# EasyEDA Pro project coreboards.mod001.rp2350.v01.eprj

# Schematic coreboards.mod001.rp2350.v01
Board Name: coreboards.mod001.rp2350.v01; Create Date: 2026-03-10; Page Name: coreboard; Project Name: coreboards.mod001.rp2350.v01; Schematic Name: coreboards.mod001.rp2350.v01; Update Date: 2026-03-16; Company: EasyEDA.com; Page Size: A4; Version: V1.0
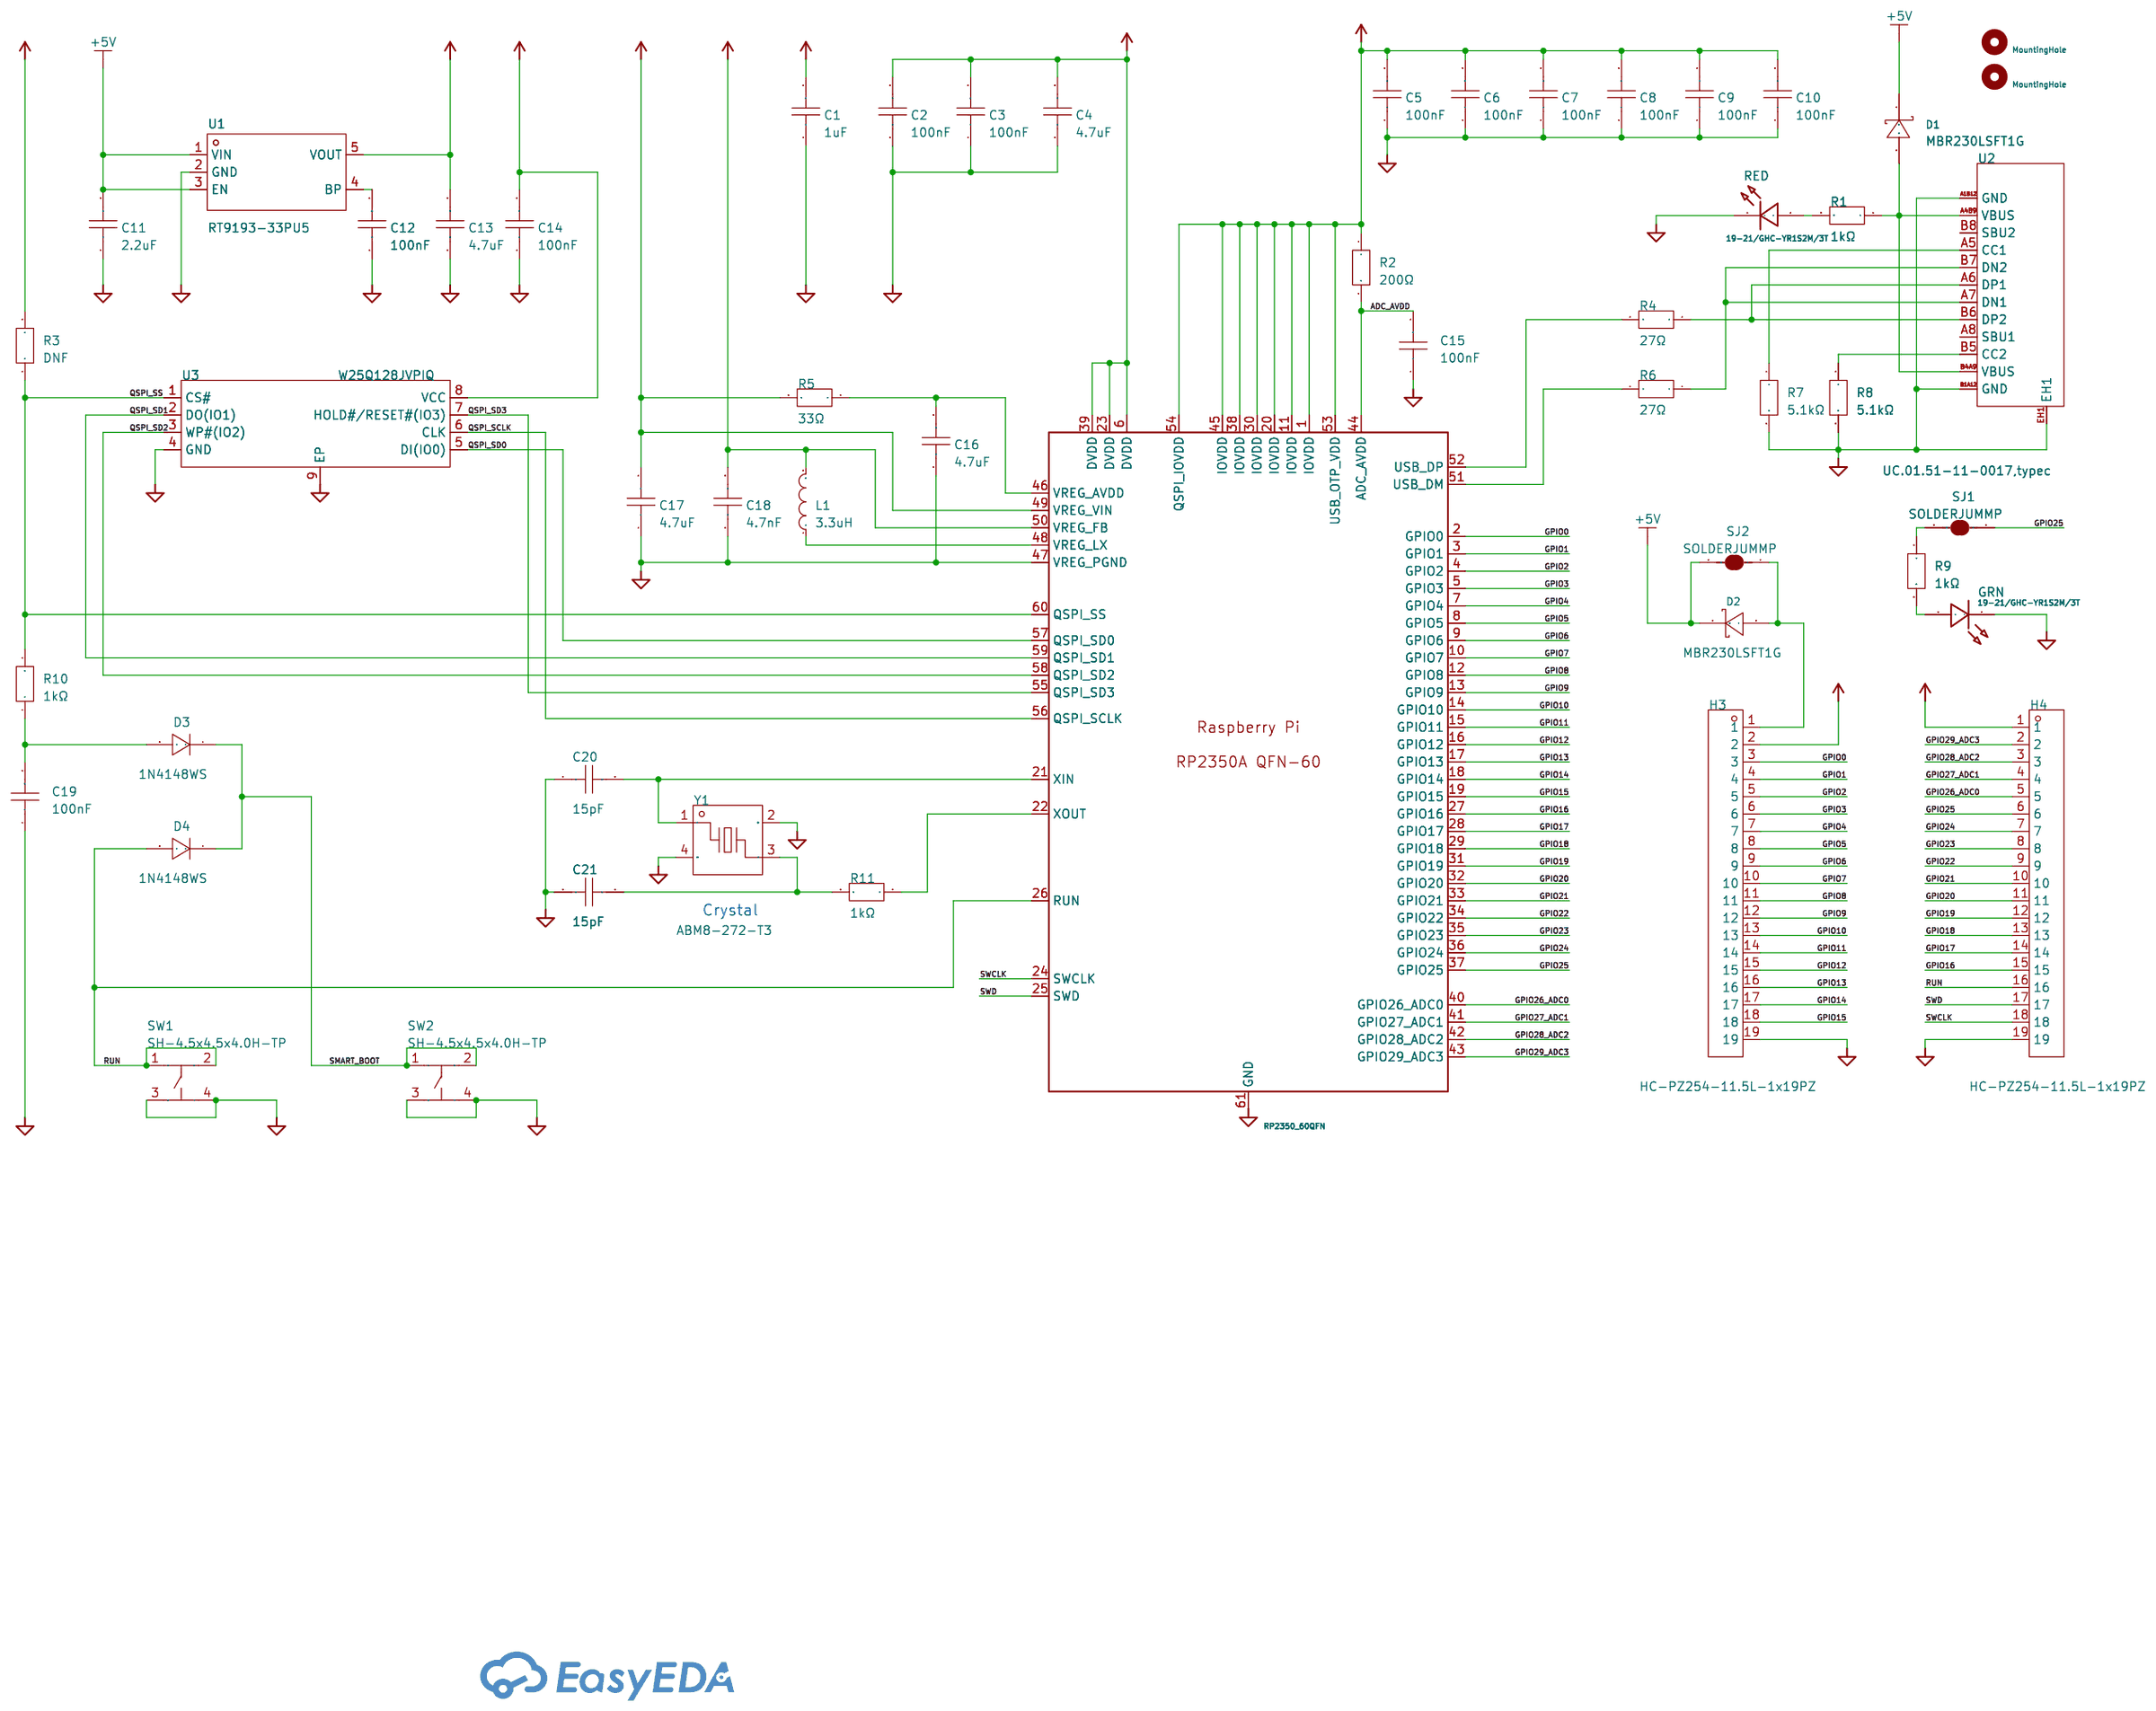
[diagram p0: schematic sheet]

## Parts
C1  1uF  [C0603]
C2  100nF  [C0603]
C3  100nF  [C0603]
C4  4.7uF  [C0603]
C5  100nF  [C0603]
C6  100nF  [C0603]
C7  100nF  [C0603]
C8  100nF  [C0603]
C9  100nF  [C0603]
C10  100nF  [C0603]
C11  2.2uF  [C0603]
C12  100nF  [C0603]
C13  4.7uF  [C0603]
C14  100nF  [C0603]
C15  100nF  [C0603]
C16  4.7uF  [C0603]
C17  4.7uF  [C0603]
C18  4.7nF  [C0603]
C19  100nF  [C0603]
C20  15pF  [C0603]
C21  15pF  [C0603]
D1  MBR230LSFT1G  [SOD-123FL_L2.7-W1.8-LS3.8-RD]
D2  MBR230LSFT1G  [SOD-123FL_L2.7-W1.8-LS3.8-RD]
D3  1N4148WS  [SOD-323_L1.8-W1.3-LS2.5-RD]
D4  1N4148WS  [SOD-323_L1.8-W1.3-LS2.5-RD]
GRN  19-21/GHC-YR1S2M/3T  [LED-SMD_L1.6-W0.8-RD]
H1  MountingHole  [MountingHole:MountingHole_2.7mm_M2.5]
H2  MountingHole  [MountingHole:MountingHole_2.7mm_M2.5]
H3  HC-PZ254-11.5L-1x19PZ  [HDR-TH_19P-P2.54-V-M]
H4  HC-PZ254-11.5L-1x19PZ  [HDR-TH_19P-P2.54-V-M]
L1  3.3uH  [IND-SMD_L2.0-W1.6_AOTA-B201610S3R3-101-T]
R1  1kΩ  [R0603]
R2  200Ω  [R0603]
R3  DNF  [R0603]
R4  27Ω  [R0603]
R5  33Ω  [R0603]
R6  27Ω  [R0603]
R7  5.1kΩ  [R0603]
R8  5.1kΩ  [R0603]
R9  1kΩ  [R0603]
R10  1kΩ  [R0603]
R11  1kΩ  [R0603]
RED  19-21/GHC-YR1S2M/3T  [LED-SMD_L1.6-W0.8-RD]
SJ1  SOLDERJUMMP  [SJ_2S-NO]
SJ2  SOLDERJUMMP  [SJ_2S-NO]
SW1  SH-4.5x4.5x4.0H-TP  [SW-SMD_4P-SH-4.5X4.5X4.0H-TP]
SW2  SH-4.5x4.5x4.0H-TP  [SW-SMD_4P-SH-4.5X4.5X4.0H-TP]
U1  RT9193-33PU5  [SC-70-5_L2.0-W1.3-P0.65-LS2.1-BL]
U2  UC.01.51-11-0017,typec  [TYPE-C-SMD_UC.01.51-11-0017]
U3  W25Q128JVPIQ  [WSON-8_L5.0-W6.0-P1.27-BL-EP]
U4  RP2350_60QFN  [RP2350_60QFN_minimal:RP2350-QFN-60-1EP_7x7_P0.4mm_EP3.4x3.4mm_ThermalVias]
Y1  ABM8-272-T3  [CRYSTAL-SMD_4P-L3.2-W2.5-BL-2]

## Library data of the parts
C1-C21 = C0603C102J2GECAUTO: LCSC Part Name: 1nF ±5% 200V; Supplier Part: C2169812; Manufacturer: KEMET(基美); Supplier Footprint: 0603; JLCPCB Part Class: Extended Part; Datasheet: https://item.szlcsc.com/datasheet/C0603C102J2GECAUTO/2261877.html; Supplier: LCSC; Tolerance: ±5%; Voltage Rating: 200V; Temperature Coefficient: C0G
D1 D2 = MBR230LSFT1G: LCSC Part Name: 电压:30V 电流:2A; Supplier Part: C126673; Manufacturer: onsemi(安森美); Supplier Footprint: SOD-123FL; JLCPCB Part Class: Extended Part; Datasheet: https://item.szlcsc.com/datasheet/MBR230LSFT1G/137953.html; Supplier: LCSC; Voltage - Forward(Vf@If): 430mV@2A; Voltage - DC Reverse(Vr): 30V; Current - Rectified: 2A; Reverse Leakage Current (Ir): 1mA@30V; Operating Junction Temperature Range: -55℃~+125℃; Non-Repetitive Peak Forward Surge Current: 40A
D3 D4 = 1N4148WS_C2128: LCSC Part Name: 丝印T4 1N4148WS; Supplier Part: C2128; Manufacturer: CJ(江苏长电/长晶); Supplier Footprint: SOD-323; JLCPCB Part Class: Basic Part; Datasheet: https://item.szlcsc.com/datasheet/1N4148WS/2485.html; Supplier: LCSC; Diode Configuration: Independent; Voltage - Forward(Vf@If): 1.25V@150mA; Voltage - DC Reverse(Vr): 100V; Current - Rectified: 150mA; Pd - Power Dissipation: 200mW; Reverse Leakage Current (Ir): 1uA@75V; Reverse Recovery Time (trr): 4ns; Non-Repetitive Peak Forward Surge Current: 2A
GRN RED = 19-21/GHC-YR1S2M/3T: Supplier: LCSC; Supplier Part: C605453; Manufacturer: EVERLIGHT(亿光); JLCPCB Part Class: Extended Part; Contributor: LCSC; spicePre: L
H1 = Mechanical_MountingHole: Attribute1: H2
H2 = Mechanical_MountingHole
H3 H4 = HC-PZ254-11.5L-1x19PZ: LCSC Part Name: 1x19P 间距:2.54mm 方针 直插; Supplier Part: C27985198; Manufacturer: HC(虹成电子); Supplier Footprint: 插件,P=2.54mm; JLCPCB Part Class: Extended Part; Datasheet: https://item.szlcsc.com/datasheet/HC-PZ254-11.5L-1x19PZ/29721156.html; Supplier: LCSC; Pin Structure: 1x19P; Pitch: 2.54mm; Circluar Pins/Square Pins: Pin Header; Mounting Type: Through Hole; Number of Rows: 1; Number of Pins: 19P; Current Rating: 3A; Length of Mating Pin: 6mm; Insulation Height: 2.5mm; Length of End Connection Pin: 3mm; Contact Material: Brass; Contact Plating: Gold; Operating Temperature: -40℃~+105℃; Color: Black
L1 = AOTA-B201610S3R3-101-T: LCSC Part Name: 3.3uH 2.4A; Supplier Part: C42411119; Manufacturer: ABRACON; Supplier Footprint: 0806; JLCPCB Part Class: Extended Part; Datasheet: https://item.szlcsc.com/datasheet/AOTA-B201610S3R3-101-T/44392932.html; Supplier: LCSC; Current Rating: 2.1A; Current - Saturation(Isat): 2.4A; DC Resistance(DCR): 115mΩ; Type: Molded Inductor
R1-R11 = RCC06031K50FKEA: LCSC Part Name: 厚膜电阻 1.5kΩ ±1% 200mW; Supplier Part: C4303195; Manufacturer: VISHAY(威世); Supplier Footprint: 0603; JLCPCB Part Class: Extended Part; Datasheet: https://item.szlcsc.com/datasheet/RCC06031K50FKEA/4873636.html; Supplier: LCSC; Type: Thick Film Resistor; Tolerance: ±1%; Power(Watts): 200mW; Temperature Coefficient: ±100ppm/℃; Operating Temperature: -55℃~+155℃
SJ1 SJ2 = SOLDERJUMPERNO: Contributor: SparkFun; spicePre: S
SW1 SW2 = SH-4.5x4.5x4.0H-TP: LCSC Part Name: TS4540TP 250gf编带; Supplier Part: C52092029; Manufacturer: SHOU HAN(首韩); Supplier Footprint: SMD; JLCPCB Part Class: Extended Part; Datasheet: https://item.szlcsc.com/datasheet/SH-4.5x4.5x4.0H-TP/54864053.html; Supplier: LCSC
U1 = RT9193-33PU5: Supplier Part: C23384; Supplier Footprint: SC-70-5; JLCPCB Part Class: Extended Part; Supplier: LCSC
U2 = UC.01.51-11-0017,typec: Supplier Part: C9900066641; Supplier Footprint: usb-c-smd_type-c-6pin; JLCPCB Part Class: Extended Part; Supplier: LCSC
U3 = W25Q128JVPIQ_C2803379: LCSC Part Name: 支持双路/四路SPI接口的3V、128Mbit 串行闪存; Supplier Part: C2803379; Manufacturer: Winbond(华邦); Supplier Footprint: WSON-8-EP(5x6); JLCPCB Part Class: Extended Part; Datasheet: https://item.szlcsc.com/datasheet/W25Q128JVPIQ/2946213.html; Supplier: LCSC; Interface: SPI; Memory Size: 128Mbit; Clock Frequency: 133MHz; Voltage - Supply: 2.7V~3.6V; Program / Erase Cycles: 100,000 Cycles; Page Programming Time (Tpp): 400us; Block Erase Time(tBE): 120ms@(32KB); Data Retention - TDR (Year): 20 Years; Operating Temperature: -40℃~+85℃
U4 = MCU_RaspberryPi_RP2350_RP2350_60QFN: Attribute1: U1
Y1 = ABM8-272-T3: Supplier Part: C9900091606; Supplier Footprint: SMD; Supplier: LCSC

## Nets
+5V: C11.2 D1.1(C) D2.1(C) SJ2.2 U1.1(VIN) U1.3(EN)
ADC_AVDD: C15.2 R2.2 U4.44(ADC_AVDD)
GPIO0: H3.3 U4.2(GPIO0)
GPIO1: H3.4 U4.3(GPIO1)
GPIO2: H3.5 U4.4(GPIO2)
GPIO3: H3.6 U4.5(GPIO3)
GPIO4: H3.7 U4.7(GPIO4)
GPIO5: H3.8 U4.8(GPIO5)
GPIO6: H3.9 U4.9(GPIO6)
GPIO7: H3.10 U4.10(GPIO7)
GPIO8: H3.11 U4.12(GPIO8)
GPIO9: H3.12 U4.13(GPIO9)
GPIO10: H3.13 U4.14(GPIO10)
GPIO11: H3.14 U4.15(GPIO11)
GPIO12: H3.15 U4.16(GPIO12)
GPIO13: H3.16 U4.17(GPIO13)
GPIO14: H3.17 U4.18(GPIO14)
GPIO15: H3.18 U4.19(GPIO15)
GPIO16: H4.15 U4.27(GPIO16)
GPIO17: H4.14 U4.28(GPIO17)
GPIO18: H4.13 U4.29(GPIO18)
GPIO19: H4.12 U4.31(GPIO19)
GPIO20: H4.11 U4.32(GPIO20)
GPIO21: H4.10 U4.33(GPIO21)
GPIO22: H4.9 U4.34(GPIO22)
GPIO23: H4.8 U4.35(GPIO23)
GPIO24: H4.7 U4.36(GPIO24)
GPIO25: H4.6 SJ1.1 U4.37(GPIO25)
GPIO26_ADC0: H4.5 U4.40(GPIO26_ADC0)
GPIO27_ADC1: H4.4 U4.41(GPIO27_ADC1)
GPIO28_ADC2: H4.3 U4.42(GPIO28_ADC2)
GPIO29_ADC3: H4.2 U4.43(GPIO29_ADC3)
POWER_+1V1: C2.2 C3.2 C4.2 C18.2 L1.2 U4.6(DVDD) U4.23(DVDD) U4.39(DVDD) U4.50(VREG_FB)
POWER_+3V3: C1.2 C5.2 C6.2 C7.2 C8.2 C9.2 C10.2 C13.2 C14.2 C17.2 H3.2 H4.1 R2.1 R3.2 R5.2 U1.5(VOUT) U3.8(VCC) U4.1(IOVDD) U4.11(IOVDD) U4.20(IOVDD) U4.30(IOVDD) U4.38(IOVDD) U4.45(IOVDD) U4.49(VREG_VIN) U4.53(USB_OTP_VDD) U4.54(QSPI_IOVDD)
POWER_GND: C1.1 C2.1 C3.1 C4.1 C5.1 C6.1 C7.1 C8.1 C9.1 C10.1 C11.1 C12.1 C13.1 C14.1 C15.1 C16.1 C17.1 C18.1 C19.1 C20.1 C21.1 GRN.1(-) H3.19 H4.19 R7.2 R8.2 RED.1(-) SW1.3 SW1.4 SW2.3 SW2.4 U1.2(GND) U2.A1B12(GND) U2.B1A12(GND) U2.EH1 U3.4(GND) U3.9(EP) U4.47(VREG_PGND) U4.61(GND) Y1.2(GND) Y1.4(GND)
QSPI_SCLK: U3.6(CLK) U4.56(QSPI_SCLK)
QSPI_SD0: U3.5(DI(IO0)) U4.57(QSPI_SD0)
QSPI_SD1: U3.2(DO(IO1)) U4.59(QSPI_SD1)
QSPI_SD2: U3.3(WP#(IO2)) U4.58(QSPI_SD2)
QSPI_SD3: U3.7(HOLD#/RESET#(IO3)) U4.55(QSPI_SD3)
QSPI_SS: R3.1 R10.2 U3.1(CS#) U4.60(QSPI_SS)
RUN: D4.2(A) H4.16 SW1.1 SW1.2 U4.26(RUN)
SMART_BOOT: D3.1(K) D4.1(K) SW2.1 SW2.2
SWCLK: H4.18 U4.24(SWCLK)
SWD: H4.17 U4.25(SWD)
$1N452: R4.2 U4.52(USB_DP)
$1N453: R6.2 U4.51(USB_DM)
$1N454: R4.1 U2.A6(DP1) U2.B6(DP2)
$1N455: R6.1 U2.A7(DN1) U2.B7(DN2)
$1N456: D1.2(A) R1.1 U2.A4B9(VBUS) U2.B4A9(VBUS)
$1N458: R7.1 U2.A5(CC1)
$1N459: R8.1 U2.B5(CC2)
$1N1604: C21.2 R11.2 Y1.3
$1N1613: R11.1 U4.22(XOUT)
$1N2950: C12.2 U1.4(BP)
$1N4805: C19.2 D3.2(A) R10.1
$1N6481: D2.2(A) H3.1 SJ2.1
$1N8578: R1.2 RED.2(+)
$1N8767: R9.1 SJ1.2
$1N8801: GRN.2(+) R9.2
$1N10436: C20.2 U4.21(XIN) Y1.1
$1N16119: C16.2 R5.1 U4.46(VREG_AVDD)
$1N16408: L1.1 U4.48(VREG_LX)

Not connected (* = marked no-connect by the designer): U2 A8(SBU1) B8(SBU2)

## Notes on the sheet
- Crystal

# Board coreboards.mod001.rp2350.v01
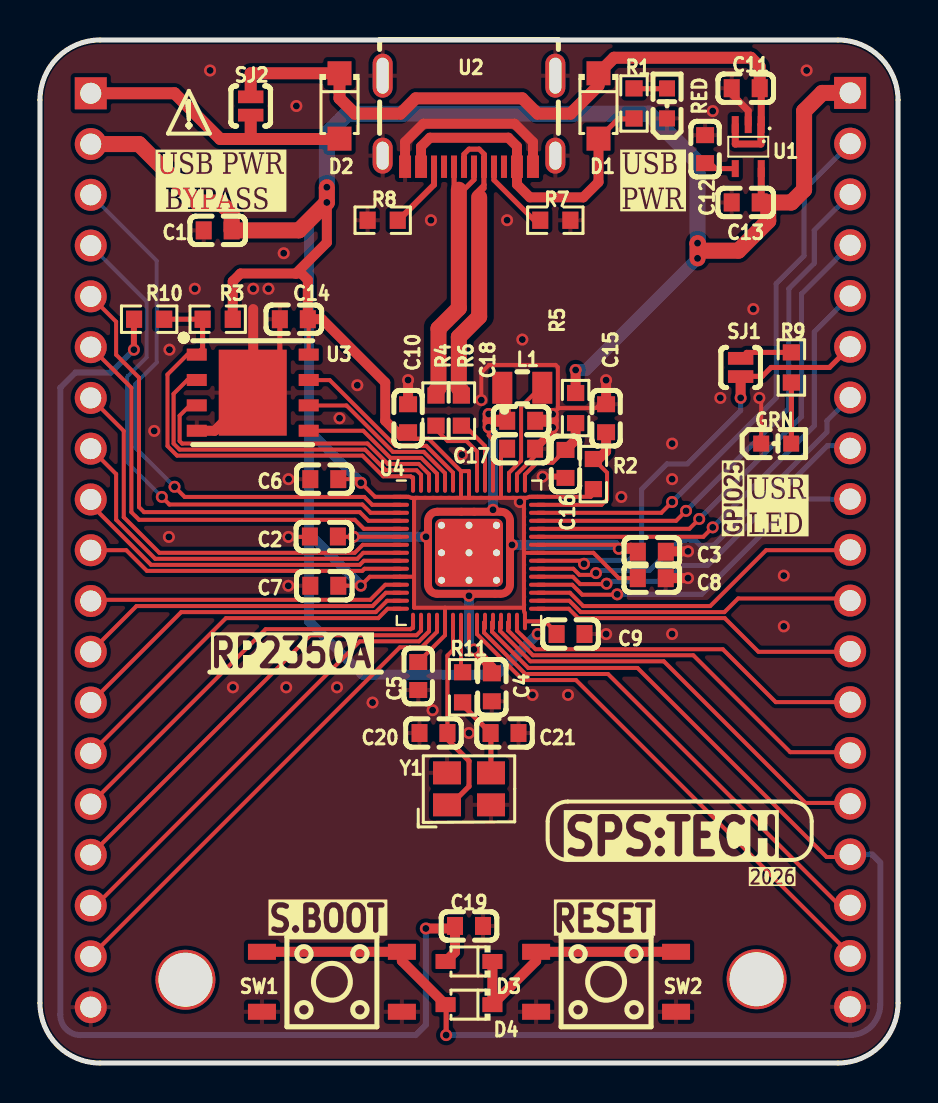
[diagram p1: board, top side]
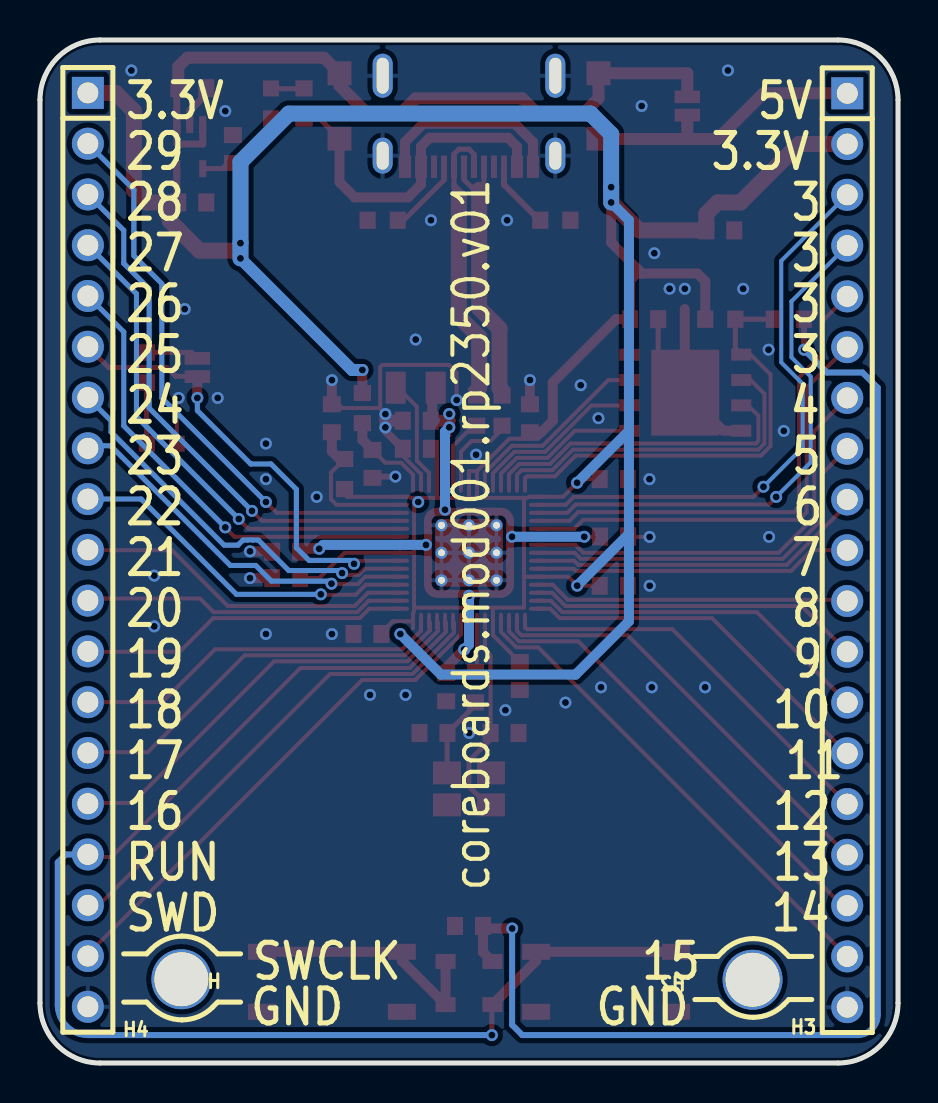
[diagram p2: board, bottom side, seen from below]

Outline 42.93 x 51.18 mm; copper layers: Top Layer, Bottom Layer. Coordinates in mm from the lower left corner of the outline.
Outline path: 0,48.18 0,3 arc(0.88,0.88) 3,0 39.93,0 arc(42.05,0.88) 42.93,3 42.93,48.18 arc(42.05,50.3) 39.93,51.18 3,51.18 arc(0.88,50.3) 0,48.18
Stack: Top Layer 0.035mm / Dielectric1 1.51mm FR4 er 4.5 / Bottom Layer 0.035mm

## Design rules (mm)
template: JLCPCB Capability(Two Layers Board)
spacing copperThickness1oz (default): track to track 0.102, other pairs 0.152 to 0.3
spacing copperThickness2oz: track to track 0.203, other pairs 0.152 to 0.3
track width copperThickness1oz (default): min 0.127, default 0.254, max 2.54
track width copperThickness2oz: min 0.203, default 0.254, max 2.54
differential pair differentialPair (default): width min 0.127, default 0.254, max 2.54; gap min 0.152, default 0.152
via viaSize (default): diameter min 0.5, default 0.61, max 10; hole min 0.3, default 0.305, max 6.3

## Placement (name value [footprint] x y rotation side)
C1  1uF  [C0603]  8.89 41.66 0 top
C2  100nF  [C0603]  14.2 26.34 0 top
C3  100nF  [C0603]  30.61 25.58 180 top
C4  4.7uF  [C0603]  22.61 18.8 90 top
C5  100nF  [C0603]  18.92 19.36 90 top
C6  100nF  [C0603]  14.22 29.21 0 top
C7  100nF  [C0603]  14.22 23.88 0 top
C8  100nF  [C0603]  30.61 24.26 180 top
C9  100nF  [C0603]  26.54 21.46 180 top
C10  100nF  [C0603]  18.41 32.26 270 top
C11  2.2uF  [C0603]  35.31 48.77 0 top
C12  100nF  [C0603]  33.27 45.72 270 top
C13  4.7uF  [C0603]  35.31 43.05 0 top
C14  100nF  [C0603]  12.7 37.21 0 top
C15  100nF  [C0603]  28.32 32.26 270 top
C16  4.7uF  [C0603]  26.29 29.97 90 top
C17  4.7uF  [C0603]  24.07 30.73 180 top
C18  4.7nF  [C0603]  24.07 32.13 180 top
C19  100nF  [C0603]  21.46 6.86 180 top
C20  15pF  [C0603]  19.69 16.51 0 top
C21  15pF  [C0603]  23.24 16.51 180 top
D1  MBR230LSFT1G  [SOD-123FL_L2.7-W1.8-LS3.8-RD]  27.94 47.88 270 top
D2  MBR230LSFT1G  [SOD-123FL_L2.7-W1.8-LS3.8-RD]  14.99 47.88 270 top
D3  1N4148WS  [SOD-323_L1.8-W1.3-LS2.5-RD]  21.46 5.08 180 top
D4  1N4148WS  [SOD-323_L1.8-W1.3-LS2.5-RD]  21.46 2.92 180 top
GRN  19-21/GHC-YR1S2M/3T  [LED-SMD_L1.6-W0.8-RD]  36.83 30.99 0 top
H1  MountingHole  [MountingHole:MountingHole_2.7mm_M2.5]  35.85 4.19 0 top
H2  MountingHole  [MountingHole:MountingHole_2.7mm_M2.5]  7.28 4.17 0 top
H3  HC-PZ254-11.5L-1x19PZ  [HDR-TH_19P-P2.54-V-M]  2.54 25.65 270 bottom
H4  HC-PZ254-11.5L-1x19PZ  [HDR-TH_19P-P2.54-V-M]  40.53 25.67 270 bottom
L1  3.3uH  [IND-SMD_L2.0-W1.6_AOTA-B201610S3R3-101-T]  24.13 33.78 180 top
R1  1kΩ  [R0603]  29.72 48.01 90 top
R2  200Ω  [R0603]  27.69 29.46 90 top
R3  DNF  [R0603]  8.89 37.21 0 top
R4  27Ω  [R0603]  19.81 32.64 270 top
R5  33Ω  [R0603]  26.8 32.77 90 top
R6  27Ω  [R0603]  21.08 32.64 270 top
R7  5.1kΩ  [R0603]  25.78 42.16 0 top
R8  5.1kΩ  [R0603]  17.15 42.16 180 top
R9  1kΩ  [R0603]  37.59 34.8 270 top
R10  1kΩ  [R0603]  5.46 37.21 0 top
R11  1kΩ  [R0603]  21.14 18.8 270 top
RED  19-21/GHC-YR1S2M/3T  [LED-SMD_L1.6-W0.8-RD]  31.37 48.01 90 top
SJ1  SOLDERJUMMP  [SJ_2S-NO]  35.05 34.8 90 top
SJ2  SOLDERJUMMP  [SJ_2S-NO]  10.54 47.88 90 top
SW1  SH-4.5x4.5x4.0H-TP  [SW-SMD_4P-SH-4.5X4.5X4.0H-TP]  14.6 4.06 0 top
SW2  SH-4.5x4.5x4.0H-TP  [SW-SMD_4P-SH-4.5X4.5X4.0H-TP]  28.32 4.06 0 top
U1  RT9193-33PU5  [SC-70-5_L2.0-W1.3-P0.65-LS2.1-BL]  35.43 45.85 180 top
U2  UC.01.51-11-0017,typec  [TYPE-C-SMD_UC.01.51-11-0017]  21.46 47.12 180 top
U3  W25Q128JVPIQ  [WSON-8_L5.0-W6.0-P1.27-BL-EP]  10.64 33.54 270 top
U4  RP2350_60QFN  [RP2350_60QFN_minimal:RP2350-QFN-60-1EP_7x7_P0.4mm_EP3.4x3.4mm_ThermalVias]  21.46 25.53 0 top
Y1  ABM8-272-T3  [CRYSTAL-SMD_4P-L3.2-W2.5-BL-2]  21.46 13.72 0 top

## Footprints (pads in the part's own frame, mm; a bottom-side part is the same pattern mirrored in y, then rotated)
C0603
  rect 0.8x0.9 smd: 1(-0.7,0) 2(0.7,0)
CRYSTAL-SMD_4P-L3.2-W2.5-BL-2
  rect 1.4x1.15 smd: 1(-1.1,-0.8) 2(1.1,-0.8) 3(1.1,0.8) 4(-1.1,0.8)
HDR-TH_19P-P2.54-V-M
  rect 1.6x1.6 hole 1.05: 1(-22.86,0)
  round 1.6 hole 1.05: 2(-20.32,0) 3(-17.78,0) 4(-15.24,0) 5(-12.7,0) 6(-10.16,0) 7(-7.62,0) 8(-5.08,0) 9(-2.54,0) 10(0,0) 11(2.54,0) 12(5.08,0) 13(7.62,0) 14(10.16,0) 15(12.7,0) 16(15.24,0) 17(17.78,0) 18(20.32,0) 19(22.86,0)
IND-SMD_L2.0-W1.6_AOTA-B201610S3R3-101-T
  rect 1x1.6 smd: 1(-1,0) 2(1,0)
LED-SMD_L1.6-W0.8-RD
  rect 0.8x0.8 smd: 1(-0.75,0) 2(0.75,0)
MountingHole:MountingHole_2.7mm_M2.5
  round 3 hole 2.7: (0,0)
R0603
  rect 0.806x0.864 smd: 1(-0.753,0) 2(0.753,0)
RP2350_60QFN_minimal:RP2350-QFN-60-1EP_7x7_P0.4mm_EP3.4x3.4mm_ThermalVias
  rrect 1.2x1.2 smd: (-0.7,0.7) (-0.7,-0.7) (0.7,0.7) (0.7,-0.7)
  rrect 0.875x0.2 smd: 1(-3.438,2.8) 2(-3.438,2.4) 3(-3.438,2) 4(-3.438,1.6) 5(-3.438,1.2) 6(-3.438,0.8) 7(-3.438,0.4) 8(-3.438,0) 9(-3.438,-0.4) 10(-3.438,-0.8) 11(-3.438,-1.2) 12(-3.438,-1.6) 13(-3.438,-2) 14(-3.438,-2.4) 15(-3.438,-2.8) 31(3.438,-2.8) 32(3.438,-2.4) 33(3.438,-2) 34(3.438,-1.6) 35(3.438,-1.2) 36(3.438,-0.8) 37(3.438,-0.4) 38(3.438,0) 39(3.438,0.4) 40(3.438,0.8) 41(3.438,1.2) 42(3.438,1.6) 43(3.438,2) 44(3.438,2.4) 45(3.438,2.8)
  rrect 0.2x0.875 smd: 16(-2.8,-3.438) 17(-2.4,-3.438) 18(-2,-3.438) 19(-1.6,-3.438) 20(-1.2,-3.438) 21(-0.8,-3.438) 22(-0.4,-3.438) 23(0,-3.438) 24(0.4,-3.438) 25(0.8,-3.438) 26(1.2,-3.438) 27(1.6,-3.438) 28(2,-3.438) 29(2.4,-3.438) 30(2.8,-3.438) 46(2.8,3.438) 47(2.4,3.438) 48(2,3.438) 49(1.6,3.438) 50(1.2,3.438) 51(0.8,3.438) 52(0.4,3.438) 53(0,3.438) 54(-0.4,3.438) 55(-0.8,3.438) 56(-1.2,3.438) 57(-1.6,3.438) 58(-2,3.438) 59(-2.4,3.438) 60(-2.8,3.438)
  round 0.6 hole 0.35: 61(-1.375,1.375) 61(-1.375,0) 61(-1.375,-1.375) 61(0,1.375) 61(0,0) 61(0,-1.375) 61(1.375,0) 61(1.375,-1.375)
  rrect 3.4x3.4 smd: 61(0,0)
  round 0.6 hole 0.36: 61(1.375,1.375)
SC-70-5_L2.0-W1.3-P0.65-LS2.1-BL
  rect 0.35x0.85 smd: 1(-0.65,-1.1) 2(0,-1.1) 3(0.65,-1.1) 4(0.65,1.1) 5(-0.65,1.1)
SJ_2S-NO
  rect 0.635x1.27 smd: 1(-0.457,0) 2(0.457,0)
SOD-123FL_L2.7-W1.8-LS3.8-RD
  rect 1.2x1.2 smd: 1(-1.635,0) 2(1.635,0)
SOD-323_L1.8-W1.3-LS2.5-RD
  rect 1x0.75 smd: 1(-1.173,0) 2(1.173,0)
SW-SMD_4P-SH-4.5X4.5X4.0H-TP
  rect 1.4x0.8 smd: 1(-3.5,1.5) 2(3.5,1.5) 3(-3.5,-1.5) 4(3.5,-1.5)
TYPE-C-SMD_UC.01.51-11-0017
  rect 0.6x1.12 smd: A1B12(-3.2,2.277) A4B9(-2.4,2.277) B1A12(3.2,2.277) B4A9(2.4,2.277)
  rect 0.3x1.12 smd: A5(-1.25,2.277) A6(-0.25,2.277) A7(0.25,2.277) A8(1.25,2.277) B5(1.75,2.277) B6(0.75,2.277) B7(-0.75,2.277) B8(-1.75,2.277)
  oval 1x1.8 hole 0.6x1.4: EH1(-4.32,1.722) EH1(4.32,1.722)
  oval 1x2.2 hole 0.6x1.8: EH1(-4.32,-2.277) EH1(4.32,-2.277)
WSON-8_L5.0-W6.0-P1.27-BL-EP
  rect 0.6x1 smd: 1(-1.905,-2.8) 2(-0.635,-2.8) 3(0.635,-2.8) 4(1.905,-2.8) 5(1.905,2.8) 6(0.635,2.8) 7(-0.635,2.8) 8(-1.905,2.8)
  rect 4.3x3.4 smd: 9(0,0)

## Nets
As in the schematic.

Pads without a net: U2 A8 B8

## Via types
v1: diameter 0.6, hole 0.35, Top Layer to Bottom Layer, 78 vias

## Routing (per net, layer and track width the routed paths; a pad name or vN(x,y) marks a point on that pad's centre or on a via; arc(x,y) is an arc through that point)
+5V: length 36.6
  Top Layer w0.35: 36.08,48.64 U1.1 36.07,46.95 36.07,45.97 34.78,45.97 U1.3
  Top Layer w0.6: C11.2 36.01,49.85 35.56,50.29 28.72,50.29 D1.1 27.94,48.89 26.54,47.5 24.89,47.5 24.13,48.26 18.8,48.26 18.03,47.5 15.75,47.5 14.99,48.26 D2.1 10.54,49.51 SJ2.2
ADC_AVDD: length 7.3
  Top Layer w0.2: R2.2 28.37,29.53 28.37,28.2 28.09,27.93 U4.44
  Top Layer w0.5: 28.32,31.3 28.32,30.6 27.81,30.09
GPIO0: length 28.9
  Top Layer w0.2: U4.2 16.62,27.93 16.22,28.32 7.24,28.32 v1(6.73,28.83)
  Bottom Layer w0.2: H3.3 5.84,40.13 5.84,35.05 4.77,33.98 4.77,30.79 v1(6.73,28.83)
GPIO1: length 27.1
  Top Layer w0.2: U4.3 16.54,27.53 16.13,27.94 6.48,27.94 v1(6.1,28.32)
  Bottom Layer w0.2: v1(6.1,28.32) 4.37,30.05 4.37,34.34 5.33,35.31 5.33,38.1 H3.4
GPIO2: length 24.9
  Top Layer w0.2: H3.5 3.81,37.08 3.81,35.43 4.95,34.29 4.95,27.81 5.21,27.56 16,27.56 16.43,27.13 18.03,27.13
GPIO3: length 22.9
  Top Layer w0.2: H3.6 4.57,33.78 4.57,27.56 4.95,27.18 15.75,27.18 16.2,26.73 U4.5
GPIO4: length 21.4
  Top Layer w0.2: U4.7 16.15,25.93 15.75,25.53 5.97,25.53 4.19,27.3 4.19,31.62 H3.7
GPIO5: length 19.2
  Top Layer w0.2: H3.8 3.81,29.46 3.81,27.18 5.76,25.22 15.87,25.22 16.18,25.53 U4.8
GPIO6: length 17.1
  Top Layer w0.2: H3.9 2.54,27.94 5.56,24.92 16,24.92 16.2,25.13 18.03,25.13
GPIO7: length 16
  Top Layer w0.2: H3.10 4.32,25.65 5.35,24.62 16.12,24.62 16.23,24.73 U4.10
GPIO8: length 15.8
  Top Layer w0.2: U4.12 17.28,23.93 16.52,23.17 2.6,23.17 H3.11
GPIO9: length 16.7
  Top Layer w0.2: H3.12 4.83,22.86 16.64,22.86 17.3,23.53 U4.13
GPIO10: length 17.6
  Top Layer w0.2: 18.03,23.13 17.37,23.13 16.8,22.56 7.06,22.56 H3.13
GPIO11: length 18.5
  Top Layer w0.2: U4.15 17.39,22.73 16.92,22.26 9.3,22.26 H3.14
GPIO12: length 20.1
  Top Layer w0.2: H3.15 11.29,21.7 18.54,21.7 18.66,21.82 18.66,22.09
GPIO13: length 21.6
  Top Layer w0.2: H3.16 13.53,21.4 18.84,21.4 19.06,21.62 U4.17
GPIO14: length 23.1
  Top Layer w0.2: H3.17 2.78,7.87 16,21.1 18.96,21.1 19.46,21.6 U4.18
GPIO15: length 24.6
  Top Layer w0.2: U4.19 19.86,21.57 19.09,20.8 18,20.8 H3.18
GPIO16: length 21.6
  Top Layer w0.2: H4.15 40.49,13.01 38.3,13.01 31.21,20.1 24.54,20.1 23.01,21.62 23.01,22.04 U4.27
GPIO17: length 20.1
  Top Layer w0.2: U4.28 23.41,22.04 23.41,21.65 24.66,20.4 32.69,20.4 37.53,15.55 40.49,15.55 H4.14
GPIO18: length 18.6
  Top Layer w0.2: U4.29 23.86,21.62 24.79,20.7 34.16,20.7 36.81,18.05 H4.13
GPIO19: length 16.5
  Top Layer w0.2: H4.12 40.51,20.57 35.94,20.57 34.26,22.26 26.93,22.26 26.46,22.73 U4.31
GPIO20: length 16.2
  Top Layer w0.2: H4.11 40.42,23.24 34.93,23.24 34.24,22.56 27.05,22.56 26.48,23.13 24.9,23.13
GPIO21: length 17.1
  Top Layer w0.2: U4.33 26.51,23.53 27.18,22.86 33.53,22.86 36.32,25.65 40.51,25.65 H4.10
GPIO22: length 17.8
  Top Layer w0.2: U4.34 26.63,23.93 27.13,23.43 28.86,23.43 v1(28.88,23.45)
  Bottom Layer w0.254: v1(28.88,23.45) 33.1,23.45 37.87,28.21 H4.9
GPIO23: length 18.7
  Top Layer w0.2: v1(28.34,23.98) 28.32,23.96 27.02,23.96 26.66,24.33 24.9,24.33
  Bottom Layer w0.254: v1(28.34,23.98) 28.47,24.11 31.35,24.11 32.13,24.89 33.4,24.89 39.39,30.88 40.4,30.88 H4.8
GPIO24: length 20
  Top Layer w0.2: v1(27.81,24.51) 27.72,24.42 26.99,24.42 26.68,24.73 U4.36
  Bottom Layer w0.254: v1(27.81,24.51) 27.94,24.51 28.07,24.64 30.48,24.64 32,26.16 32.29,26.16 arc(32.42,26.18) 32.55,26.16 32.77,26.16 33.02,25.91 33.71,25.91 39.37,31.57 39.37,32.13 40.53,33.29
GPIO25: length 22.9
  Top Layer w0.2: v1(27.22,24.97) 27.06,25.13 24.9,25.13
  Top Layer w0.254: SJ1.1 35.06,34.35 36.13,34.35 36.58,34.8 39.5,34.8 H4.6
  Top Layer w0.5: v1(35.05,33.27) SJ1.1
  Bottom Layer w0.254: v1(35.05,33.27) 35.05,32.64 32.38,29.97 31.37,29.97 30.1,28.7 30.1,25.78 29.46,25.15 27.39,25.15 v1(27.22,24.97)
GPIO26_ADC0: length 23.4
  Top Layer w0.2: 24.9,26.33 33.19,26.33 v1(33.66,26.8)
  Bottom Layer w0.254: H4.5 38.74,36.58 38.74,31.88 v1(33.66,26.8)
GPIO27_ADC1: length 25.1
  Top Layer w0.2: v1(32.98,27.22) 32.49,26.73 U4.41
  Bottom Layer w0.254: v1(32.98,27.22) 38.1,32.34 38.1,38.48 H4.4
GPIO28_ADC2: length 26.9
  Top Layer w0.2: v1(32.32,27.62) 31.83,27.13 24.9,27.13
  Bottom Layer w0.254: H4.3 38.74,41.66 38.74,40 37.47,38.73 37.47,32.77 v1(32.32,27.62)
GPIO29_ADC3: length 28.6
  Top Layer w0.2: U4.43 31.08,27.53 v1(31.62,28.07)
  Bottom Layer w0.254: 40.53,45.99 38.23,43.69 38.23,40.39 36.83,38.99 36.83,33.27 v1(31.62,28.07)
POWER_+1V1: length 50
  Top Layer w0.2: v1(22.45,31.8) 22.45,31.4 22.65,31.2 22.65,30.18 22.66,30.17 22.66,28.96 ; 29.76,25.73 29.56,25.93 U4.39 ; v1(21.71,20.69) 21.46,20.93 U4.23 ; 18.03,26.33 v1(15.69,26.33) 14.92,26.33 C2.2
  Top Layer w0.4: 19.41,27.12 arc(19.55,27.44) 19.87,27.58 23,27.58 ; 19.41,27.06 19.41,23.94 arc(19.55,23.61) 19.87,23.47 23,23.47 ; 23.05,27.58 arc(23.38,27.44) 23.51,27.12 ; 23.51,23.99 23.51,27.06 ; 23.51,23.94 arc(23.38,23.61) 23.05,23.47 ; 23.51,24.76 23.51,24.51
  Top Layer w0.5: v1(21.71,20.69) 22.61,19.79 C4.2 ; v1(28.96,25.73) 29.76,25.73 C3.2 ; 23.3,32.13 23.3,33.61 L1.2
  Top Layer w0.6: 22.45,32.13 v1(22.45,31.8) ; 22.45,32.13 v1(22.45,32.47) ; 22.45,32.13 23.3,32.13
  Bottom Layer w0.5: v1(23.62,25.92) 28.76,25.92 v1(28.96,25.73) ; v1(19.31,26.33) 15.7,26.33 ; v1(22.66,27.68) 22.66,31.59 v1(22.45,31.8) ; v1(21.46,23.37) 21.46,20.93 v1(21.71,20.69)
POWER_+3V3: length 189.3
  Top Layer w0.2: 17.96,24.33 18.68,24.33 18.72,24.29 ; 17.61,31.63 18.01,31.23 18.99,31.23 ; 18.8,28.27 18.72,28.19 18.72,22.78 24.21,22.78 ; 18.8,28.27 21.06,28.27 ; 18.8,28.27 18.61,28.27 arc(18.52,28.29) 18.44,28.33 16.76,28.33 15.88,29.21 C6.2 ; 20.26,22.78 20.26,22.78 U4.20 20.26,21.4 C5.2 ; 21.06,29.61 21.46,29.61 21.46,29.36 ; 21.06,29.61 U4.54 21.06,28.27 ; 21.06,29.61 19.44,31.23 18.74,31.23 C10.2 ; 21.46,29.48 21.46,29.28 ; 23.04,28.27 23.06,28.3 U4.49 23.06,30.49 23.3,30.73 ; 24.21,25.5 24.24,25.53 U4.38 27.69,25.53 28.96,24.26 C8.2 ; 21.06,28.27 21.46,28.27 ; 21.46,28.27 U4.53 ; 21.46,28.27 24.21,28.27 ; 24.26,22.48 24.25,22.53 arc(24.22,22.6) 24.21,22.68 24.21,22.78 arc(24.21,22.78) 24.21,22.78 24.21,28.27 ; U3.8 13.44,37.17 C14.2 ; 18.03,24.33 16.5,24.33 v1(16.05,23.88) 15.31,23.88 15.31,23.88 ; 27.69,28.46 27.56,28.33 24.48,28.33 arc(24.4,28.29) 24.31,28.27 24.21,28.27 ; U4.30 24.27,22.1 25.27,22.1 25.72,21.65 25.72,21.21
  Top Layer w0.35: 36.43,43.05 36.08,43.4 U1.5
  Top Layer w0.5: 12.8,39.5 13.08,39.5 13.4,39.18 C14.2 14.11,37.21 17.27,34.05 17.27,32.13 17.84,31.56 C10.2 ; 12.8,39.5 14.35,41.05 v1(14.35,43.05) ; 12.8,39.5 10.03,39.5 9.64,39.11 R3.2 ; R5.2 v1(26.8,34.67)
  Top Layer w0.8: H4.1 39.14,48.53 38.23,47.62 38.23,43.69 37.59,43.05 36.43,43.05 36.43,42.13 34.94,40.64 33.27,40.64 ; v1(32.9,41.02) 32.91,41 32.9,40.99 v1(32.9,40.25) ; v1(14.35,43.81) v1(14.35,43.05) 12.95,41.66 C1.2 9.59,42.49 9.02,43.05 7.87,43.05 4.95,45.97 H3.2
  Bottom Layer w0.5: 13.46,31.62 13.46,42.16 v1(14.35,43.05) ; 13.46,31.62 v1(16.06,29.03) ; 13.46,31.62 13.46,26.47 ; v1(24.9,21.46) 22.87,19.43 16.13,19.43 13.46,22.1 13.46,26.47 ; v1(16.05,23.88) 13.46,26.47
  Bottom Layer w0.6: v1(26.8,34.67) 27.31,34.67 v1(32.9,40.25)
  Bottom Layer w0.8: v1(32.9,40.25) v1(32.9,41.02) 32.9,45.07 30.47,47.5 15.38,47.5 14.35,46.47 v1(14.35,43.81) v1(14.35,43.05)
  vias: v1(24,28.07)
POWER_GND: length 49.7
  Top Layer w0.2: U4.47 23.86,29.46 24.7,30.3 24.7,30.73 ; C15.1 28,32.96 27.81,32.77 25.95,32.77 25.91,32.73 ; v1(22.08,33.16) 22.08,34.54 22.46,34.92 25.8,34.92 25.91,34.81 25.91,32.73 ; 25.91,32.73 v1(25.65,32.46) ; v1(35.99,33.27) 36.08,33.18 GRN.1 ; C2.1 13.48,26.32 v1(12.43,26.32)
  Top Layer w0.203: 20.47,26.5 21.47,25.5
  Top Layer w0.254: 10.67,33.56 12,34.89 C14.1
  Top Layer w0.3: v1(25.15,29.34) 26.22,29.34 C16.1
  Top Layer w0.35: 34.43,48.64 35.43,47.64 U1.2
  Top Layer w0.4: C17.1 25.65,31.61
  Top Layer w0.5: v1(32.42,24.26) 31.31,24.26 ; v1(32.42,25.6) 31.33,25.6 C3.1 ; U3.4 8.74,31.63 U3.9 10.67,33.56 10.67,37.72 ; C10.1 v1(18.41,34.17) ; 24.66,44.84 24.66,46.08 23.75,46.99 19.18,46.99 18.26,46.08 U2.B1A12 ; C15.1 v1(28.32,34.16)
  Top Layer w0.6: 25.65,32.16 v1(25.65,31.8) ; 25.65,32.16 v1(25.65,32.46) ; 25.65,32.16 25.62,32.13 24.7,32.13
  vias: v1(5.72,31.62) v1(6.45,26.32) v1(6.48,35.69) v1(7.75,38.73) v1(8.51,49.66) v1(9.65,18.8) v1(10.67,38.73) v1(11.43,38.73) v1(12.19,40.51) v1(12.32,18.8) v1(12.43,29.21) v1(12.42,23.88) v1(12.83,47.88) v1(14.86,18.8) v1(14.99,32.26) v1(15.88,33.91) v1(16.64,18.03) v1(19.56,42.16) v1(19.64,17.65) v1(21.11,30.43) v1(21.46,16.51) v1(23.37,42.16) v1(24.13,36.19) v1(24.64,18.41) v1(26.42,18.41) v1(28.32,21.46) v1(29.08,28.32) v1(31.62,30.99) v1(31.62,29.21) v1(31.62,21.46) v1(33.66,47.62) v1(34.04,33.27) v1(35.69,37.72) v1(37.21,24.38) v1(37.21,21.84) v1(38.35,49.66)
QSPI_SCLK: length 8.8
  Top Layer w0.2: U3.6 13.45,32.89 15.34,32.89 17.66,30.58 19.2,30.58 20.26,29.51 U4.56
QSPI_SD0: length 7.8
  Top Layer w0.2: U3.5 16.17,31.63 17.53,30.27 19.07,30.27 19.86,29.48 U4.57
QSPI_SD1: length 17.4
  Top Layer w0.2: U3.2 7.37,34.17 6.68,33.48 6.68,30.99 6.98,30.69 16.26,30.69 17.3,29.65 18.84,29.65 19.06,29.43 U4.59
QSPI_SD2: length 16
  Top Layer w0.2: U4.58 19.46,29.46 18.95,29.97 17.4,29.97 16.39,30.99 7.11,30.99 6.99,31.11 6.99,32.38 7.5,32.9 U3.3
QSPI_SD3: length 9.7
  Top Layer w0.2: 20.66,28.96 20.66,29.54 19.32,30.88 17.78,30.88 14.5,34.16 13.45,34.16 U3.7
QSPI_SS: length 22.5
  Top Layer w0.2: 18.66,28.96 18.66,29.23 18.54,29.35 17.17,29.35 16.14,30.39 6.86,30.39 6.38,30.86 6.38,34.45 7.37,35.44 U3.1
  Top Layer w0.254: R10.2 R3.1 8.14,35.73 U3.1
RUN: length 66.6
  Top Layer w0.2: H4.16 40.4,10.31 39.35,10.31 29.89,19.76 24.43,19.76 22.62,21.58 22.62,22.04 22.66,22.09
  Top Layer w0.254: v1(20.32,1.4) 20.32,2.89
  Top Layer w0.5: D4.2 18.1,5.11 SW1.2 SW1.1
  Bottom Layer w0.3: v1(20.32,1.4) 40.51,1.4 arc(41.59,1.84) 42.04,2.92 42.04,10.03 41.64,10.43 H4.16
SMART_BOOT: length 12.7
  Top Layer w0.5: D3.1 D4.1 24.82,5.11 SW2.1 SW2.2
SWCLK: length 26
  Top Layer w0.2: U4.24 21.86,21.45 24.16,19.16 26.81,19.16 40.53,5.44 H4.18
SWD: length 24.5
  Top Layer w0.2: H4.17 39.99,7.89 28.42,19.46 24.28,19.46 22.22,21.53 22.22,22.04 U4.25
$1N452: length 4.4
  Top Layer w0.2: U4.52 21.86,30.59 21.34,31.11 20.39,31.11 19.69,31.82 19.69,31.89
$1N453: length 3.6
  Top Layer w0.2: U4.51 22.26,30.87 21.25,31.89 20.96,31.89
$1N454: length 13.5
  Top Layer w0.254: U2.B6 20.71,43.69 21.21,43.69 21.71,44.19 U2.A6
  Top Layer w0.8: 20.96,43.69 20.96,37.76 19.94,36.75 19.94,33.77 19.81,33.65
$1N455: length 14.3
  Top Layer w0.254: 22.21,43.93 22.21,43.76 22.14,43.69 ; 22.21,43.93 U2.B7 22.22,44.85 22.22,45.47 21.97,45.72 21.46,45.72 21.21,45.47 U2.A7 ; 22.21,43.93 21.84,43.56
  Top Layer w0.8: 21.97,43.31 21.97,37.34 20.96,36.32 20.96,33.77 21.08,33.65
$1N456: length 16.8
  Top Layer w0.254: D1.2 28.93,47.24 29.72,47.24
  Top Layer w0.5: 27.94,45.99 27.94,44.07 27.18,43.31 24.51,43.31 23.86,43.95 U2.A4B9 23.86,45.86 23.43,46.29 19.51,46.29 19.06,45.85 U2.B4A9
$1N458: length 3.8
  Top Layer w0.254: U2.A5 22.71,44.17 24.72,42.16 25.01,42.16
$1N459: length 3.4
  Top Layer w0.3: U2.B5 19.71,43.94 17.94,42.16 R8.1
$1N1604: length 4.1
  Top Layer w0.254: 22.56,14.69 22.56,16.49 21.08,17.97 21.08,18.17
$1N1613: length 2.5
  Top Layer w0.2: 21.21,19.68 21.06,19.82 U4.22
$1N2950: length 1.4
  Top Layer w0.254: 33.53,45.02 33.8,44.75 U1.4
$1N4805: length 64.6
  Top Layer w0.3: R10.1 4.7,37.2 v1(4.7,35.69)
  Top Layer w0.5: D3.2 20.76,5.55 20.76,6.73 v1(19.3,6.73)
  Bottom Layer w0.3: v1(4.7,35.69) 3.56,34.54 1.78,34.54 1.02,33.78 1.02,2.41 arc(1.31,1.69) 2.03,1.4 18.8,1.4 19.3,1.91 v1(19.3,6.73)
$1N6481: length 14.6
  Top Layer w0.6: 10.49,46.23 10.54,46.28 SJ2.1 ; 10.49,46.23 9.02,46.23 6.73,48.51 H3.1 ; 10.49,46.23 14.97,46.23 D2.2
$1N8578: length 1.7
  Top Layer w0.254: 29.72,48.74 31.35,48.74 RED.2
$1N8767: length 2.7
  Top Layer w0.254: R9.1 35.35,35.55 35.05,35.25
$1N8801: length 3.1
  Top Layer w0.254: R9.2 37.59,31 GRN.2
$1N10436: length 10.3
  Top Layer w0.2: C20.2 20.38,20.38 20.66,20.66 20.66,22.09
  Top Layer w0.254: C20.2 20.38,16.19 21.46,15.11 21.46,13.84 20.62,12.99 20.36,12.99
$1N16119: length 4.6
  Top Layer w0.2: U4.46 24.26,29.44 24.86,30.03 25.65,30.03 C16.2
  Top Layer w0.5: C16.2 26.8,31.18 R5.1
$1N16408: length 5.6
  Top Layer w0.2: U4.48 23.46,29.52 24.07,30.13 24.07,32.83 25.02,33.78
  Top Layer w0.24: 25.02,33.78 L1.1

## Copper pours and planes (outline as drawn; the poured copper is in the pictures)
POWER_+3V3 on Top Layer: 18.24,28.75 24.64,28.75 24.64,22.35 18.24,22.35
POWER_GND on Top Layer: -0.51,51.56 43.56,51.56 43.56,-0.25 -0.51,-0.25
POWER_GND on Bottom Layer: 0,51.56 43.31,51.56 43.31,-0.13 0,-0.13

## Text on the board
Bottom Silkscreen Layer: coreboards.mod001.rp2350.v01 | 6 | 9 | 3 | 5 | 7 | 8 | 4 | 11 | 10 | 12 | 13 | 14 | 5V | 3.3V | 15 | GND | SWCLK | 29 | 28 | 27 | 26 | 25 | 24 | 23 | 22 | 21 | 20 | 19 | 18 | 17 | 16 | RUN | SWD
Top Silkscreen Layer: 2026 | GPIO25 | S.BOOT | RESET | RP2350A | SPS:TECH | USB PWR / BYPASS | USB / PWR | USR / LED | ⚠
